# Altium schematic sheet ЦТЕА4.324.039_Э3_1.SchDoc
size 420 x 297 mm; ApprovedBy: Забиякин; CheckedBy: Калгатин; DrawnBy: Бунтов; DocumentNumber: ЦТЕА4.324.039 Э3; SheetNumber: 1; SheetTotal: 4; Title1str: Плата управления; Title2str: и индикации телеметрии; ProcessInspection: Кудряшова; DocumentType1str: Схема электрическая; DocumentType2str: принципиальная; ImagePath: ЦТЕА4.324.039; Rule: PcbType=ProtelPcb
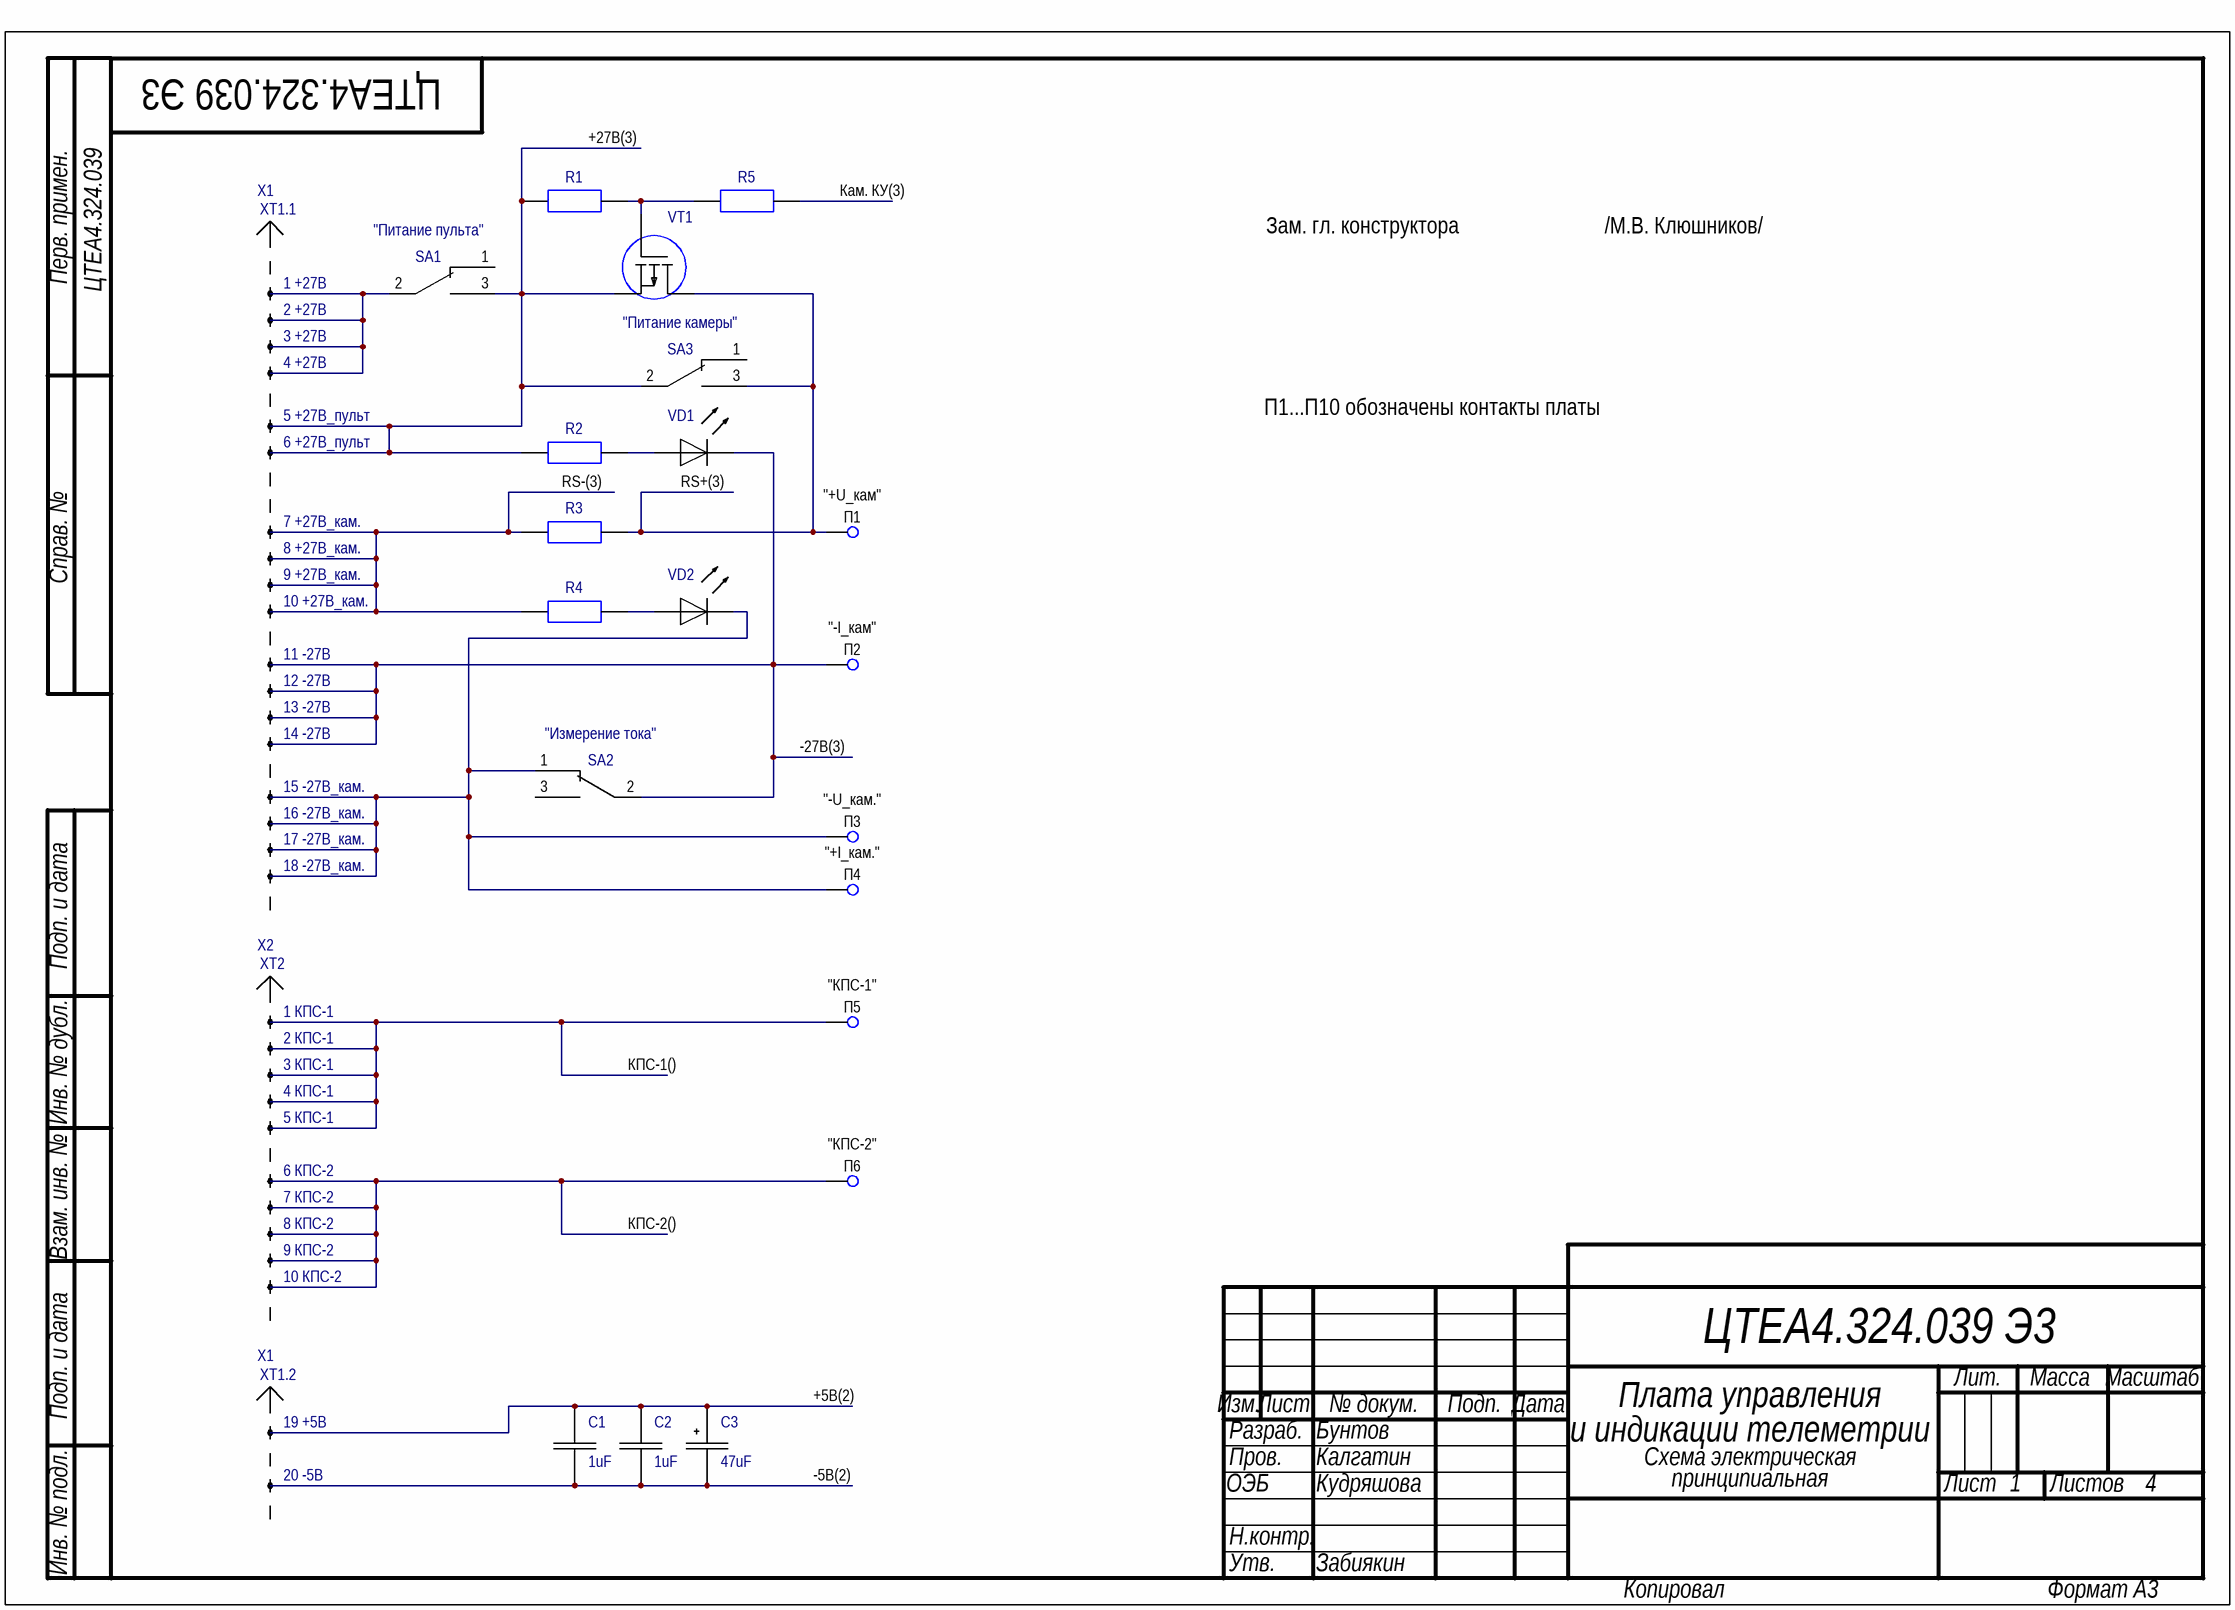
[diagram p0: ЦТЕА4.324.039_Э3_1.SchDoc]

## Parts
C1  1uF  [GRM21BR61E105KA01K]
C2  1uF  [GRM21BR61E105KA01K]
C3  47uF  [TAJV686MO35RNJ]
R1  Res  [CR1206-JW-8250ELF]  (value not drawn)
R2  Res  [CR1206-JW-4701ELF]  (value not drawn)
R3  Res  [KNP100JTB0R1-1_0000_175]  (value not drawn)
R4  Res  [CR1206-JW-4701ELF]  (value not drawn)
R5  Res  [CR1206-JW-1001ELF]  (value not drawn)
SA1  "Питание пульта"  [7107SYZQE]
SA2  "Измерение тока"  [7107SYZQE]
SA3  "Питание камеры"  [7107SYZQE]
VD1  LED  [HLMP-D150]  (value not drawn)
VD2  LED  [HLMP-D150]  (value not drawn)
VT1  IRF4905PBF  [IRF4905PBF-f1]  (value not drawn)
XT1  1 +27В  [PLD-20]  (parts A,B,C,D,E,F,G,H,I,J,K,L,M,N,O,P,Q,R,S,T of 20)
XT2  1 КПС-1  [PLD-10]  (parts A,B,C,D,E,F,G,H,I,J of 10)
П1  "+U_кам"  [ZMP]
П2  "-I_кам"  [ZMP]
П3  "-U_кам."  [ZMP]
П4  "+I_кам."  [ZMP]
П5  "КПС-1"  [ZMP]
П6  "КПС-2"  [ZMP]

## Nets
+5V: C1.2 C2.2 C3.1 XT1.19
+27В: SA1.2 XT1.1 XT1.2 XT1.3 XT1.4
+27В_кам_RS+: R3.2 SA3.3 VT1.2(D) П1.1
+27В_кам_RS-: R3.1 R4.1 XT1.7 XT1.8 XT1.9 XT1.10
+27В_пульт: R1.1 R2.1 SA1.3 SA3.2 VT1.3(S) XT1.5 XT1.6
-27В: SA2.2 VD1.2(C) XT1.11 XT1.12 XT1.13 XT1.14 П2.1
-27В_камера: SA2.1 VD2.2(C) XT1.15 XT1.16 XT1.17 XT1.18 П3.1 П4.1
Cam_power: R5.2
GND: C1.1 C2.1 C3.2 XT1.20
КПС-1: XT2.1 XT2.2 XT2.3 XT2.4 XT2.5 П5.1
КПС-2: XT2.6 XT2.7 XT2.8 XT2.9 XT2.10 П6.1
NetR1_2: R1.2 R5.1 VT1.1(G)
NetR2_2: R2.2 VD1.1(A)
NetR4_2: R4.2 VD2.1(A)

Not connected (* = marked no-connect by the designer): SA1 1; SA2 3; SA3 1

## Notes on the sheet
- ЦТЕА4.324.039 Э3
- (near R1) +27В(3)
- X1
- XT1.1
- Кам. КУ(3)
- Зам. гл. конструктора                            /М.В. Клюшников/
- (near R2) RS-(3)
- (near VD1) RS+(3)
- -27В(3)
- П1...П10 обозначены контакты платы
- X2
- (near XT2) XT2
- КПС-1()
- КПС-2()
- (near XT1) XT1.2
- +5В(2)
- -5В(2)
- Перв. примен.
- Справ. №
- Подп. и дата
- Инв. № дубл.
- Взам. инв. №
- Изм.
- Лист
- № докум.
- Подп.
- Дата
- Лит.
- Масса
- Масштаб
- ОЭБ
- Пров.
- Разраб.
- Листов
- Инв. № подл.
- Н.контр.
- Утв.
- Копировал
- Формат А3

## Library data of the parts
C1-C3 = Condensator
R1-R5 = Rezistor
SA1-SA3 = Perekljuchatel
VD1 VD2 = Svetodiod
VT1 = MOSFET-P: MOSFET
XT1 XT2 = Razem shtyrevoj: Наименование: *; Название: *
П1-П6 = Zazhim malogobaritnyj: pad_ЗМП